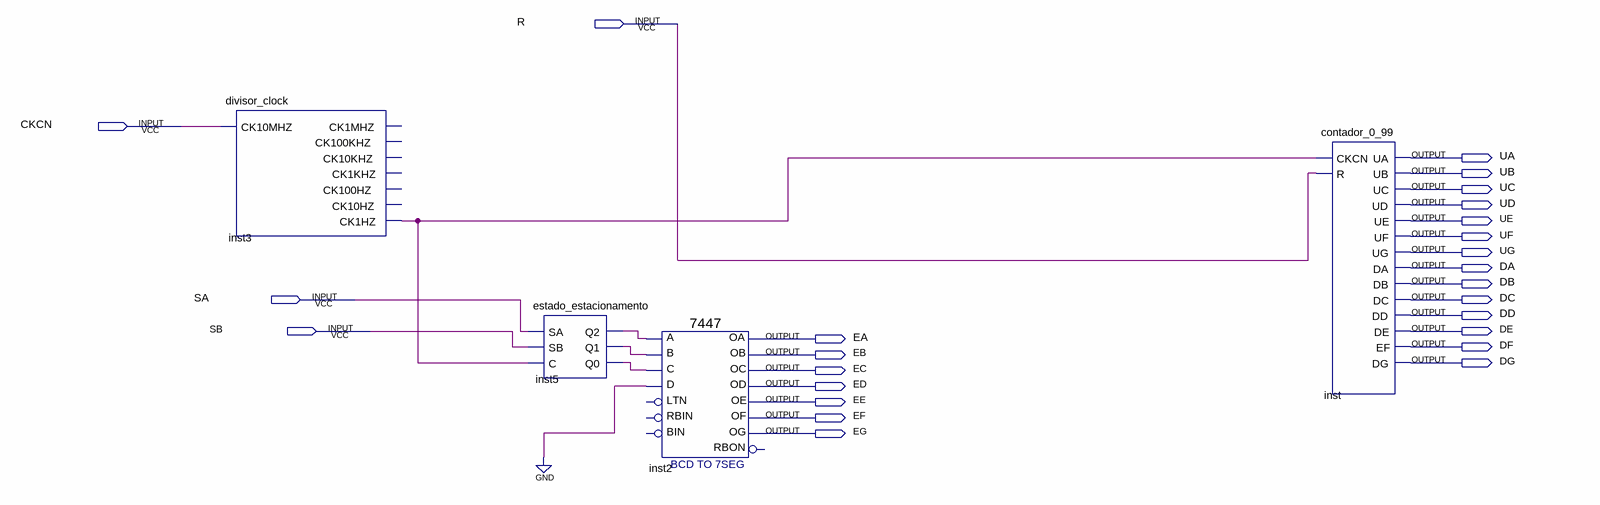
[diagram p0: schematic sheet]
// Quartus schematic estacionamento.bdf as structural Verilog: 4 symbols, 25 pins
module estacionamento (
  input  R,
  input  CKCN,
  input  SA,
  input  SB,
  output UA,
  output UB,
  output UC,
  output UD,
  output UE,
  output UF,
  output UG,
  output DA,
  output DB,
  output DC,
  output DD,
  output DE,
  output EA,
  output DF,
  output EB,
  output DG,
  output EC,
  output ED,
  output EE,
  output EF,
  output EG
);

  wire inst3_ck1hz, inst5_q0, inst5_q1, inst5_q2;

  divisor_clock inst3 (
    .CK10MHZ(CKCN), .CK1HZ(inst3_ck1hz));  // open: CK1MHZ, CK100KHZ, CK10KHZ, CK1KHZ, CK100HZ, CK10HZ
  estado_estacionamento inst5 (.SA(SA), .SB(SB), .C(inst3_ck1hz), .Q2(inst5_q2), .Q1(inst5_q1), .Q0(inst5_q0));
  \7447  inst2 (
    .B(inst5_q1), .C(inst5_q0), .D(1'b0), .A(inst5_q2), .OB(EB), .OC(EC), .OE(EE), .OD(ED), .OF(EF), .OG(EG),
    .OA(EA));  // open: LTN, RBIN, BIN, RBON
  contador_0_99 inst (
    .CKCN(inst3_ck1hz), .R(R), .UA(UA), .UB(UB), .UC(UC), .UD(UD), .UE(UE), .UF(UF), .UG(UG), .DA(DA),
    .DB(DB), .DC(DC), .DD(DD), .DE(DE), .EF(DF), .DG(DG));
endmodule
